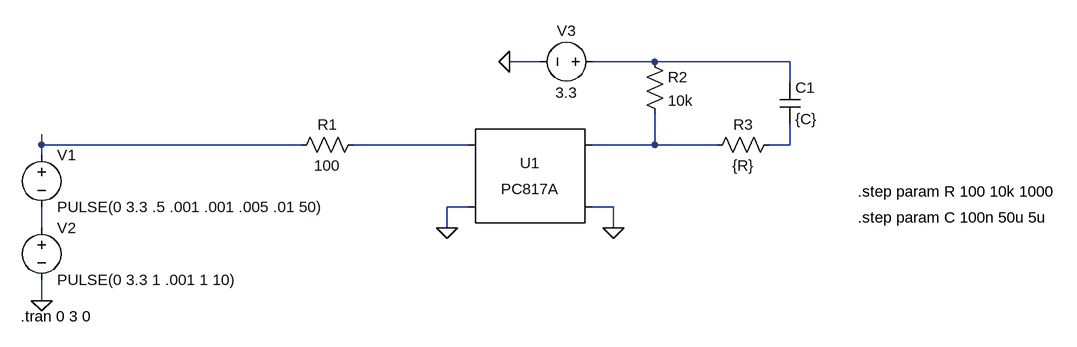
[diagram p0: schematic rotSW_sim.asc]
rotSW_sim.asc, the LTspice schematic file:
Version 4
SHEET 1 1632 680
WIRE 800 -16 752 -16
WIRE 976 -16 880 -16
WIRE 1184 -16 976 -16
WIRE 1184 16 1184 -16
WIRE 32 112 32 96
WIRE 432 112 32 112
WIRE 688 112 512 112
WIRE 976 112 976 64
WIRE 976 112 880 112
WIRE 1072 112 976 112
WIRE 1184 112 1184 80
WIRE 1184 112 1152 112
WIRE 32 128 32 112
WIRE 688 208 656 208
WIRE 912 208 880 208
WIRE 32 240 32 208
WIRE 656 240 656 208
WIRE 912 240 912 208
WIRE 32 352 32 320
FLAG 32 352 0
FLAG 656 240 0
FLAG 752 -16 0
FLAG 912 240 0
SYMBOL voltage 32 112 R0
WINDOW 123 0 0 Left 0
WINDOW 39 0 0 Left 0
SYMATTR InstName V1
SYMATTR Value PULSE(0 3.3 .5 .001 .001 .005 .01 50)
SYMBOL voltage 32 224 R0
WINDOW 123 0 0 Left 0
WINDOW 39 0 0 Left 0
SYMATTR InstName V2
SYMATTR Value PULSE(0 3.3 1 .001 1 10)
SYMBOL Optos\\PC817A 784 160 R0
SYMATTR InstName U1
SYMBOL res 416 128 R270
WINDOW 0 32 56 VTop 2
WINDOW 3 0 56 VBottom 2
SYMATTR InstName R1
SYMATTR Value 100
SYMBOL res 960 -32 R0
SYMATTR InstName R2
SYMATTR Value 10k
SYMBOL voltage 896 -16 R90
WINDOW 0 -32 56 VBottom 2
WINDOW 3 32 56 VTop 2
WINDOW 123 0 0 Left 0
WINDOW 39 0 0 Left 0
SYMATTR InstName V3
SYMATTR Value 3.3
SYMBOL res 1168 96 R90
WINDOW 0 0 56 VBottom 2
WINDOW 3 32 56 VTop 2
SYMATTR InstName R3
SYMATTR Value {R}
SYMBOL cap 1168 16 R0
SYMATTR InstName C1
SYMATTR Value {C}
TEXT 0 376 Left 2 !.tran 0 3 0
TEXT 1288 184 Left 2 !.step param R 100 10k 1000
TEXT 1288 224 Left 2 !.step param C 100n 50u 5u

The netlist it stands for:
* rotSW_sim.asc
V1 N002 N006 PULSE(0 3.3 .5 .001 .001 .005 .01 50)
V2 N006 0 PULSE(0 3.3 1 .001 1 10)
XU1 N003 0 N004 0 PC817 Igain=1m
R1 N002 N003 100
R2 N001 N004 10k
V3 N001 0 3.3
R3 N005 N004 {R}
C1 N001 N005 {C}
.tran 0 3 0
.step param R 100 10k 1000
.step param C 100n 50u 5u
.lib PC817.sub
.backanno
.end